# EAGLE design ir_serial_interface (EAGLE 6.6.0)
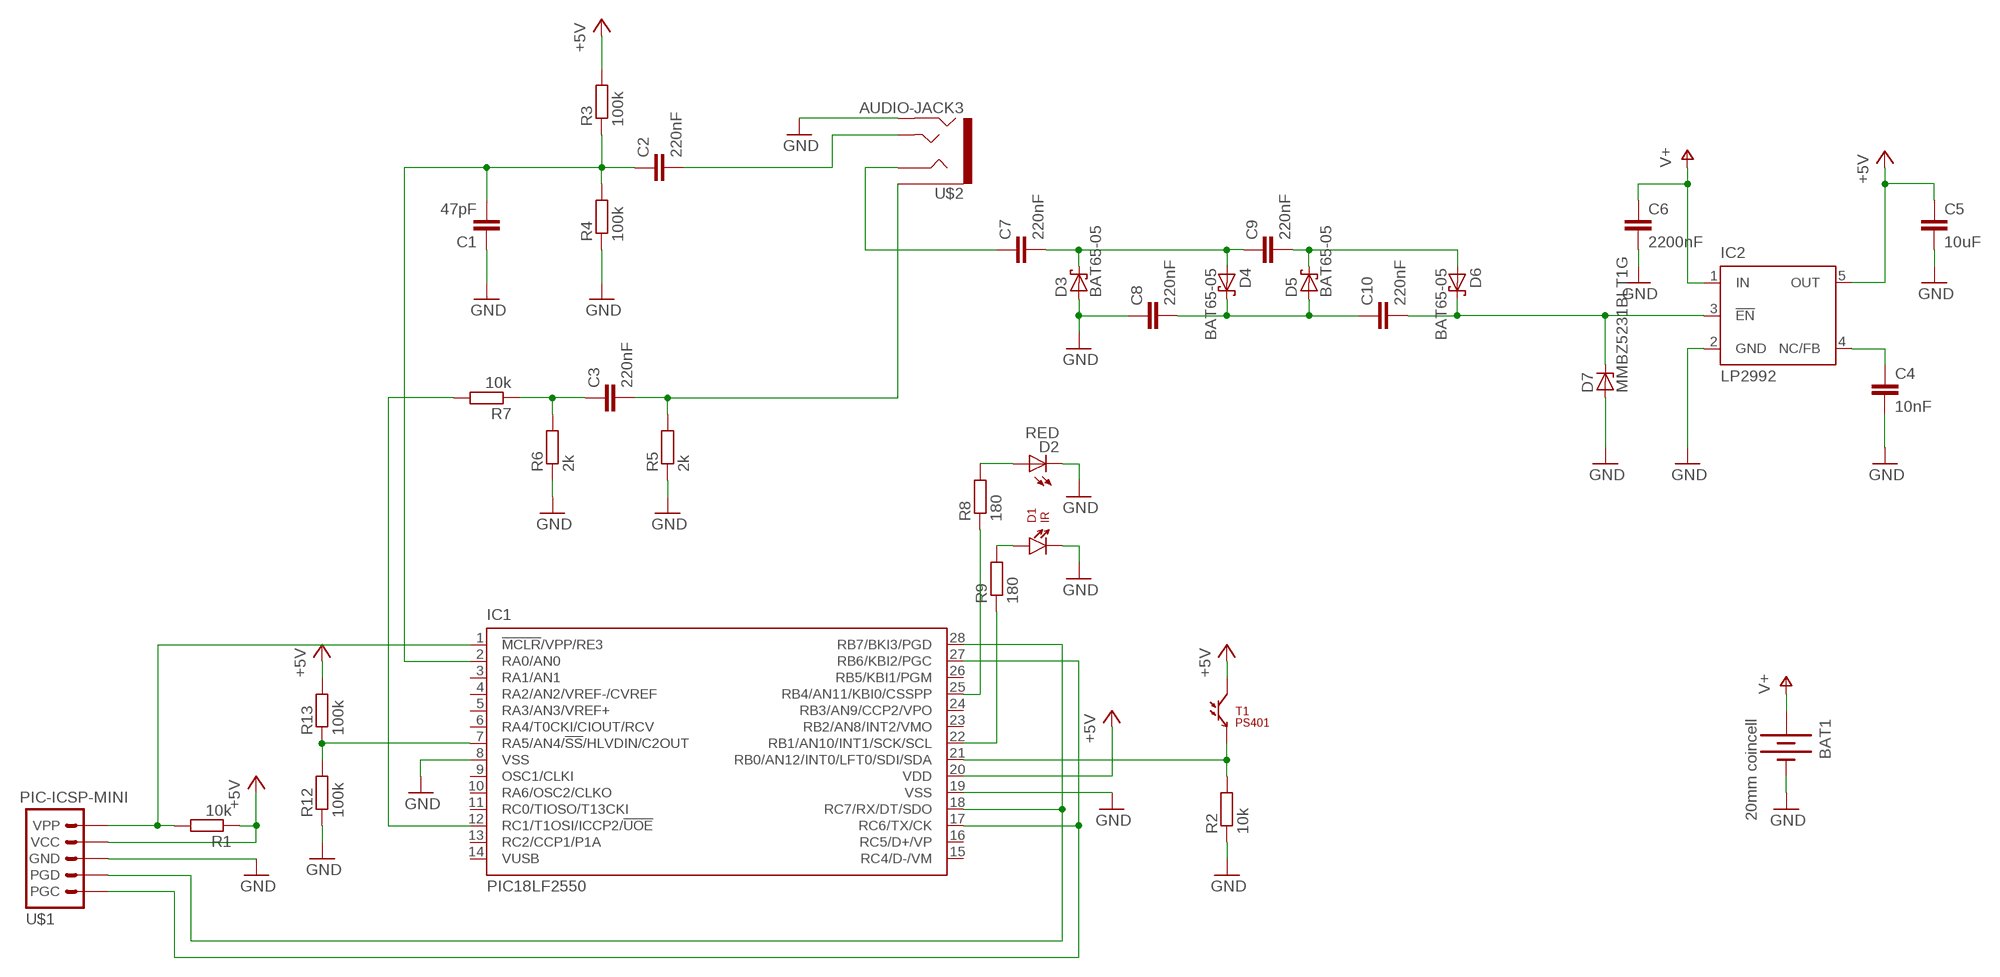
[diagram p0: schematic, sheet 1]

## Parts
BAT1  20mm coincell  BATTERY20PTH  [BATTCOM_20MM_PTH]
C1  47pF  CAP0805  [0805]
C2  220nF  CAP0805  [0805]
C3  220nF  CAP0805  [0805]
C4  10nF  C-EUC0805  [C0805]
C5  10uF  C-EUC0805  [C0805]
C6  2200nF  C-EUC0805  [C0805]
C7  220nF  C-EUC0805  [C0805]
C8  220nF  C-EUC0805  [C0805]
C9  220nF  C-EUC0805  [C0805]
C10  220nF  C-EUC0805  [C0805]
D1  IR  LTE-302  [LTE-302]
D2  RED  LED-REDLILYPAD  [LED-1206]
D3  BAT65-05  BAT54  [SOT23]
D4  BAT65-05  BAT54  [SOT23]
D5  BAT65-05  BAT54  [SOT23]
D6  BAT65-05  BAT54  [SOT23]
D7  MMBZ5231BLT1G  ZENER-DIODESOT23  [SOT23]
IC1  PIC18LF2550  PIC18F2550_28W  [SO28W]
IC2  LP2992  TPS77001  [SOT23-DBV]
R1  10k  R-EU_M0805  [M0805]
R2  10k  R-EU_M0805  [M0805]
R3  100k  R-EU_M0805  [M0805]
R4  100k  R-EU_M0805  [M0805]
R5  2k  R-EU_M0805  [M0805]
R6  2k  R-EU_M0805  [M0805]
R7  10k  R-EU_M0805  [M0805]
R8  180  R-EU_M0805  [M0805]
R9  180  R-EU_M0805  [M0805]
R12  100k  R-EU_M0805  [M0805]
R13  100k  R-EU_M0805  [M0805]
T1  PS401  LTR-301  [LTR-301]
U$1  PIC-ICSP-MINI  [PIC-ICSP-MINI]
U$2  AUDIO-JACK3  [AUDIO-JACK-TRRS-SMD]

## Nets
+5V: C5.1 IC1.20(VDD) IC2.5(OUT) R1.1 R3.2 R13.2 T1.C U$1.2(VCC)
GND: BAT1.2(-) C1.1 C4.2 C5.2 C6.2 C8.1 D1.C D2.C D3.1(A) D7.1(A) IC1.8(VSS) IC1.19(VSS) IC2.2(GND) R2.1 R4.1 R5.1 R6.1 R12.1 U$1.3(GND) U$2.RING2
N$1: IC1.21(RB0/AN12/INT0/LFT0/SDI/SDA) R2.2 T1.E
N$2: IC1.1(!MCLR!/VPP/RE3) R1.2 U$1.1(VPP)
N$3: IC1.18(RC7/RX/DT/SDO) IC1.28(RB7/BKI3/PGD) U$1.4(PGD)
N$4: IC1.17(RC6/TX/CK) IC1.27(RB6/KBI2/PGC) U$1.5(PGC)
N$5: C2.2 U$2.TIP
N$6: C1.2 C2.1 IC1.2(RA0/AN0) R3.1 R4.2
N$7: C3.2 R5.2 U$2.EARTH
N$8: C3.1 R6.2 R7.1
N$9: IC1.12(RC1/T1OSI/ICCP2/!UOE) R7.2
N$10: D2.A R8.2
N$11: IC1.25(RB4/AN11/KBI0/CSSPP) R8.1
N$12: C7.1 U$2.RING1
N$13: C7.2 C9.1 D3.3(C) D4.1(A)
N$14: D1.A R9.2
N$15: IC1.22(RB1/AN10/INT1/SCK/SCL) R9.1
N$16: IC1.7(RA5/AN4/!SS!/HLVDIN/C2OUT) R12.2 R13.1
N$17: C9.2 D5.3(C) D6.1(A)
N$18: C8.2 C10.1 D4.3(C) D5.1(A)
N$21: C10.2 D6.3(C) D7.3(C) IC2.3(!EN)
N$22: C4.1 IC2.4(NC/FB)
V+: BAT1.1(+) C6.1 IC2.1(IN)
Unconnected: IC1.3(RA1/AN1) IC1.4(RA2/AN2/VREF-/CVREF) IC1.5(RA3/AN3/VREF+) IC1.6(RA4/T0CKI/CIOUT/RCV) IC1.9(OSC1/CLKI) IC1.10(RA6/OSC2/CLKO) IC1.11(RC0/TIOSO/T13CKI) IC1.13(RC2/CCP1/P1A) IC1.14(VUSB) IC1.15(RC4/D-/VM) IC1.16(RC5/D+/VP) IC1.23(RB2/AN8/INT2/VMO) IC1.24(RB3/AN9/CCP2/VPO) IC1.26(RB5/KBI1/PGM)

## Library data of the parts
BAT1 = SparkFun-Electromechanical:BATTERY: Battery Holders Various common sizes : AA, AAA, 20mm coin cell and 12mm coin cell. 20MM_4LEGS, BATT-10373
C1-C3 = SparkFun (old):CAP: Capacitor Standard 0603 ceramic capacitor, and 0.1" leaded capacitor.
C4-C10 = rcl:C-EU: CAPACITOR, European symbol
D1 = SparkFun-LED:LTE-302: Through-hole side-firing 940nm IR LED
D2 = SparkFun-LED:LED-RED: Assorted Red LEDs LilyPad 1206- DIO-09912 1206- DIO-00809 0603- DIO-00819; PROD_ID: DIO-09912
D3-D6 = diode:BAT54: Schottky Diodes Source: Fairchild .. BAT54.pdf
D7 = diode:ZENER-DIODE: Z-Diode
IC1 = microchip:PIC18F2*_28: USB Microcontrollers with nanoWatt Technology High-Performance, Enhanced Flash, 28/40/44-Pin, Source: http://ww1.microchip.com/downloads/en/devicedoc/39632c.pdf; MF: MICROCHIP; MPN: PIC18F2550-I/SO; OC_FARNELL: 9321268; OC_NEWARK: 73K1297
IC2 = texas:TPS770*: ULTRALOW-POWER 50-mA LOW-DROPOUT LINEAR REGULATORS 50-mA Low-Dropout Regulator Source: http://focus.ti.com/lit/ds/symlink/tps77001.pdf; MF: TEXAS INSTRUMENTS; MPN: TPS77001DBVT; OC_FARNELL: 8461554; OC_NEWARK: 77C1171
R1-R9 R12 R13 = resistor:R-EU_: RESISTOR, European symbol
T1 = SparkFun-Sensors:LTR-301: Through-hole side-receiving IR phototransistor
U$1 = SparkFun-Connectors:PIC-ICSP-MINI: PIC-ICSP-Mini Miniature 5-pin connection for temporary programming of PICs. Use this device in your design to save space. Program the PIC with this adapter Spark Fun Electronics SKU : BOB-00194
U$2 = SparkFun-Connectors:AUDIO-JACK3: Audio jack - 3.5mm TRRS variety - two rings.

## Board
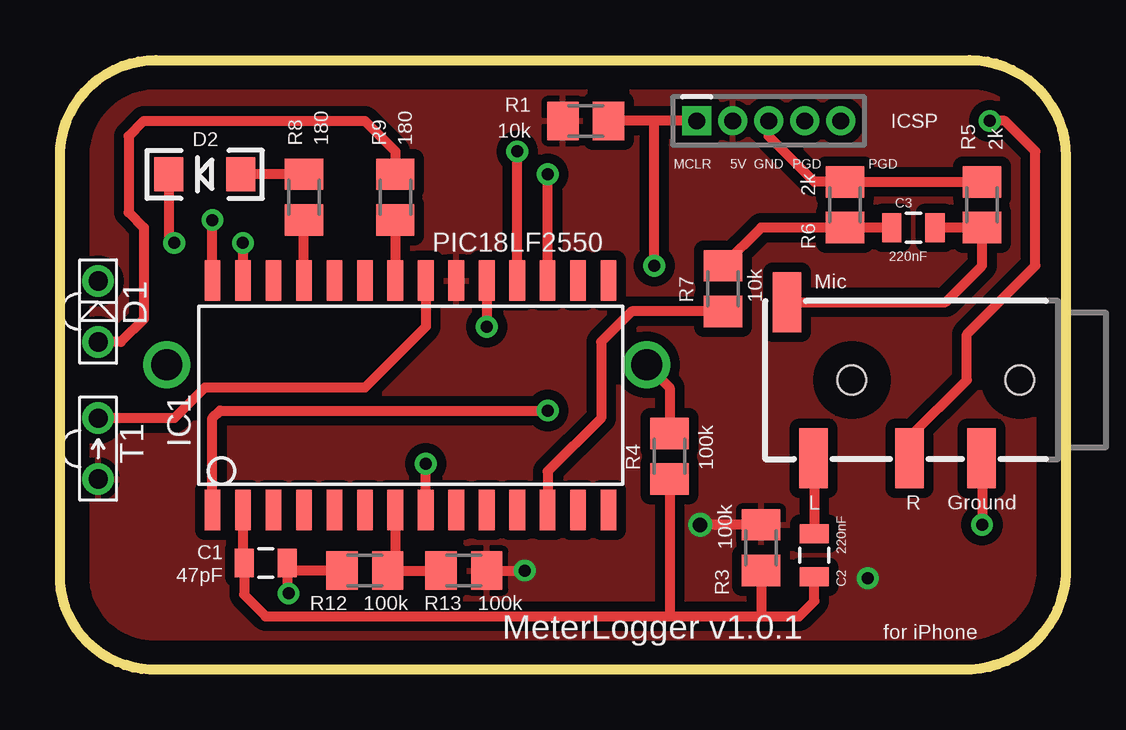
[diagram p1: board, top side]
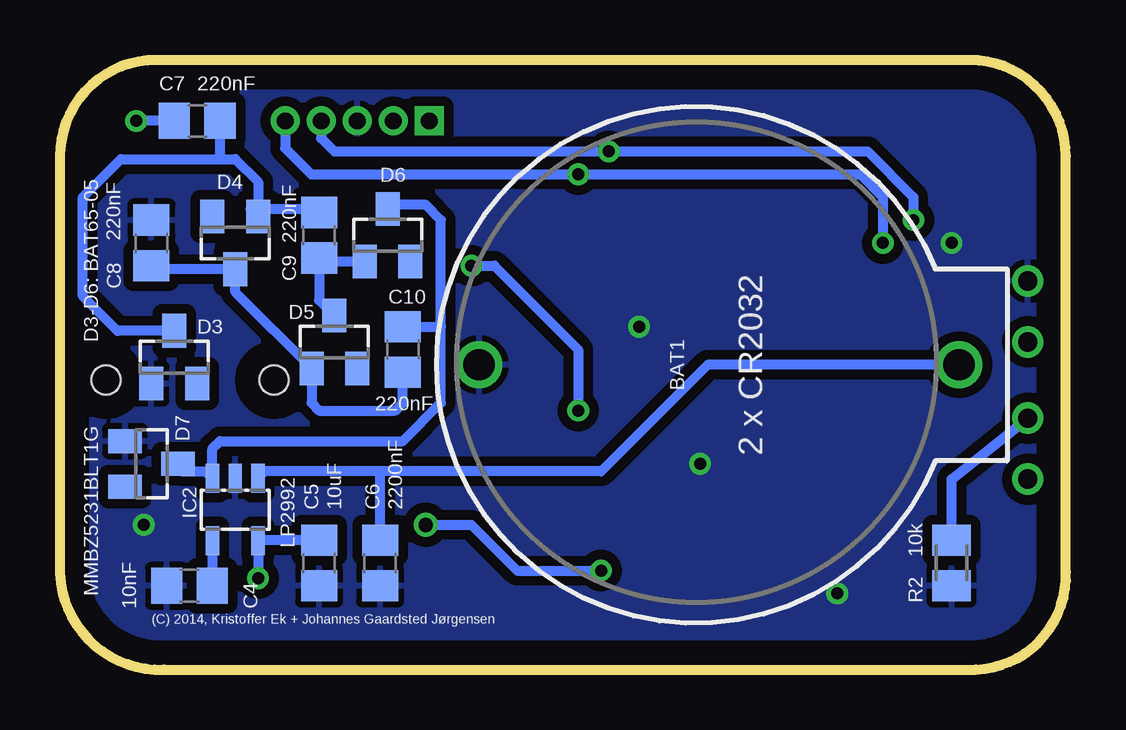
[diagram p2: board, bottom side, seen from below]

Size 41.91 x 25.4 mm. Coordinates in mm from the lower left corner, seen from the top.
Outline: 4.01,25.4 37.9,25.4 arc-90 41.91,21.39 41.91,4.01 arc-90 37.58,0 3.75,0 arc-90 0,4.07 0,21.39 arc-90 4.01,25.4
Copper layers (1*16): Top 0.035mm / dielectric 1.5mm / Bottom 0.035mm
Design rules "default": minimum track width 10mil, minimum drill 24mil, track to track 8mil, track to pad 8mil, pad to pad 8mil, via to via 8mil, smd to smd 8mil, copper to edge 40mil, drill to drill 8mil, minimum pad ring 10mil, minimum via ring 8mil, stop-mask expansion 4mil, vias tented up to drill 0mil, thermal gap 10mil

### Footprints (pad centres in the part's own frame; a part is rotated, then mirrored left to right if it is on the bottom)
BATTCOM_20MM_PTH = drill 1.3: 1 20,0; 2 0,0
0805 = smd 0.8 x 1.2: 1 -0.9,0; 2 0.9,0
C0805 = smd 1.3 x 1.5: 1 -0.95,0; 2 0.95,0
LTE-302 = drill 0.8: A 1.27,0; C -1.27,0
LED-1206 = smd 1.2 x 1.4: A -1.5,0; C 1.5,0
SOT23 = smd 1 x 1.4: 1 -0.95,-1.1; 2 0.95,-1.1; 3 0,1.1
SO28W = smd 0.65 x 1.7: 1 -7.62,-4.78; 2 -6.35,-4.78; 3 -5.08,-4.78; 4 -3.81,-4.78; 5 -2.54,-4.78; 6 -1.27,-4.78; 7 0,-4.78; 8 1.27,-4.78; 9 2.54,-4.78; 10 3.81,-4.78; 11 5.08,-4.78; 12 6.35,-4.78; 13 7.62,-4.78; 14 8.89,-4.78; 15 8.89,4.78; 16 7.62,4.78; 17 6.35,4.78; 18 5.08,4.78; 19 3.81,4.78; 20 2.54,4.78; 21 1.27,4.78; 22 0,4.78; 23 -1.27,4.78; 24 -2.54,4.78; 25 -3.81,4.78; 26 -5.08,4.78; 27 -6.35,4.78; 28 -7.62,4.78
SOT23-DBV = smd 0.55 x 1.2: 1 -0.95,-1.3; 2 0,-1.3; 3 0.95,-1.3; 4 0.95,1.3; 5 -0.95,1.3
M0805 = smd 1.3 x 1.6: 1 -0.95,0; 2 0.95,0
LTR-301 = drill 0.8: C 1.27,0; E -1.27,0
PIC-ICSP-MINI = drill 0.7 square: 1 -3,0 | drill 0.7: 2 -1.5,0; 3 0,0; 4 1.5,0; 5 3,0
AUDIO-JACK-TRRS-SMD = smd 1.2 x 2.5: EARTH 11.3,-3.25; RING1 6.2,3.25; RING2 3.2,3.25; TIP 10.2,3.25 | hole 1.2: 1.6,0; 8.6,0

### Placement (x,y rotation side)
BAT1  24.45,12.7 0 bottom
C1  8.57,4.45 180 top
C2  31.43,4.76 90 top
C3  35.56,18.41 0 top
C4  36.51,3.49 180 bottom
C5  31.12,4.45 270 bottom
C6  28.58,4.45 270 bottom
C7  36.2,22.86 0 bottom
C8  38.1,17.78 270 bottom
C9  31.12,18.1 270 bottom
C10  27.62,13.34 90 bottom
D1  1.59,14.92 270 top
D2  6.03,20.64 180 top
D3  37.15,13.02 0 bottom
D4  34.61,17.78 180 bottom
D5  30.48,13.65 0 bottom
D6  28.26,18.1 0 bottom
D7  38.1,8.57 270 bottom
IC1  13.97,11.43 0 top
IC2  34.61,6.67 180 bottom
R1  21.91,22.86 0 top
R2  4.76,4.45 90 bottom
R3  29.21,5.08 90 top
R4  25.4,8.89 270 top
R5  38.42,19.37 270 top
R6  32.7,19.37 270 top
R7  27.62,15.88 270 top
R8  10.16,19.69 90 top
R9  13.97,19.69 90 top
R12  12.7,4.13 0 top
R13  16.83,4.13 0 top
T1  1.59,9.21 270 top
U$1  29.53,22.86 0 top
U$2  41.59,12.07 180 top

### Tracks (layer width: path | path; a pad name or v marks a point on that pad's centre or on a via)
+5V  (via drill 0.5, 0.6)
  Top 0.406: R13.2 v19.37,4.13 | R3.2 27.31,6.03 v26.67,6.03
  Bottom 0.406: v33.65,3.81 v33.66,3.81 IC2.5 33.63,5.4 C5.1 | v26.67,6.03 24.76,6.03 22.86,4.13 v19.37,4.13
  pour Top (isolate 0.406): 0.32,4.11 0.32,21.71 arc-90 4.65,25.08 38.44,25.08 arc-90 41.59,21.29 41.59,4.11 arc-90 37.48,0.32 3.79,0.32 arc-90
GND  (via drill 0.5)
  Top 0.406: R5.1 R6.1 31.44,20.32 29.53,22.23 U$1.3 | IC1.19 v17.78,14.29 | D2.C 4.53,18.01 v4.76,17.78 | R12.1 9.79,4.13 C1.1 9.47,3.23 v9.53,3.18 | BAT1.2 25.4,11.75 R4.1 | U$2.RING2 38.42,8.82 v38.42,6.03 | IC1.8 v15.24,8.57
  pour Bottom (isolate 0.406): 4.11,25.08 37.8,25.08 arc-90 41.59,21.29 41.59,4.11 arc-90 37.48,0.32 3.79,0.32 arc-90 0.32,3.79 0.32,20.97 arc-90
N$1
  Top 0.406: IC1.21 15.24,14.29 12.7,11.75 6.03,11.75 4.76,10.48 T1.E
  Bottom 0.406: R2.2 4.76,7.94 T1.E
N$2  (via drill 0.5)
  Top 0.406: U$1.1 24.76,22.86 | 24.76,22.86 R1.2 | IC1.1 6.35,10.48 6.67,10.8 v20.32,10.8 | v24.76,16.83 24.76,22.86
  Bottom 0.406: v24.76,16.83 23.81,16.83 20.32,13.34 v20.32,10.8
N$3  (via drill 0.5)
  Top 0.406: IC1.28 v6.35,18.73 | IC1.18 v19.05,21.59
  Bottom 0.406: U$1.4 31.03,22.14 30.48,21.59 v19.05,21.59 8.26,21.59 6.35,19.69 v6.35,18.73
N$4  (via drill 0.5)
  Top 0.406: v7.62,17.78 IC1.27 | IC1.17 v20.32,20.64
  Bottom 0.406: U$1.5 32.53,21.73 31.43,20.64 v20.32,20.64 8.57,20.64 7.62,19.69 v7.62,17.78
N$5
  Top 0.406: U$2.TIP 31.43,8.82 C2.2
N$6
  Top 0.406: IC1.2 7.62,4.5 C1.2 7.67,3.12 8.57,2.22 25.4,2.22 | 25.4,2.22 29.21,2.22 | 29.21,2.22 30.8,2.22 31.43,2.86 C2.1 | R3.1 29.21,2.22 | R4.2 25.4,2.22
N$7
  Top 0.406: U$2.EARTH 36.9,15.32 38.42,16.83 R5.2 C3.2
N$8
  Top 0.406: C3.1 R6.2 29.22,18.42 R7.1
N$9
  Top 0.406: R7.2 23.81,14.93 22.54,13.65 22.54,10.48 20.32,8.26 IC1.12
N$10
  Top 0.406: R8.2 D2.A
N$11
  Top 0.406: IC1.25 R8.1
N$12  (via drill 0.5)
  Top 0.406: U$2.RING1 35.39,9.68 37.78,12.07 37.78,13.97 40.64,16.83 40.64,21.59 39.37,22.86 v38.73,22.86
  Bottom 0.406: C7.1 v38.73,22.86
N$13
  Bottom 0.406: C9.1 31.9,19.2 33.97,19.2 D4.1 33.65,20.32 34.61,21.27 35.24,21.27 | C7.2 35.25,21.27 35.24,21.27 | D3.3 39.52,14.12 40.96,15.56 40.96,19.69 39.37,21.27 35.24,21.27
N$14
  Top 0.406: R9.2 13.97,21.59 12.7,22.86 3.49,22.86 2.86,22.23 2.86,19.05 3.49,18.41 3.49,14.61 2.54,13.65 D1.A
N$15
  Top 0.406: R9.1 IC1.22
N$16
  Top 0.406: R13.1 R12.2 13.97,4.77 IC1.7
N$17
  Bottom 0.406: D6.1 31.6,17 C9.2 31.12,15.39 D5.3
N$18
  Bottom 0.406: D5.1 31.43,12.7 | D5.1 34.61,15.73 D4.3 37.95,16.68 C8.2 | D5.1 31.43,11.11 31.12,10.8 27.94,10.8 27.62,11.11 C10.1
N$21
  Bottom 0.406: D7.3 37.15,8.57 36.83,8.26 35.84,8.26 IC2.3 35.56,9.21 35.24,9.52 27.62,9.52 26.04,11.11 26.04,14.29 | 26.04,14.29 26.04,18.73 26.67,19.37 28.09,19.37 D6.3 | C10.2 26.04,14.29
N$22
  Bottom 0.406: IC2.4 C4.1
V+
  Bottom 0.406: BAT1.1 14.92,12.7 19.37,8.26 28.58,8.26 | 28.58,8.26 33.37,8.26 IC2.1 | C6.1 28.58,8.26

### Text on the board
_tsilk: ICSP | MCLR | 5V | GND | PGD | PGD | Mic | L | R | Ground | MeterLogger v1.0.1 | for iPhone
_bsilk: D3-D6: BAT65-05 | 2 x CR2032 | (C) 2014, Kristoffer Ek + Johannes Gaardsted Jørgensen